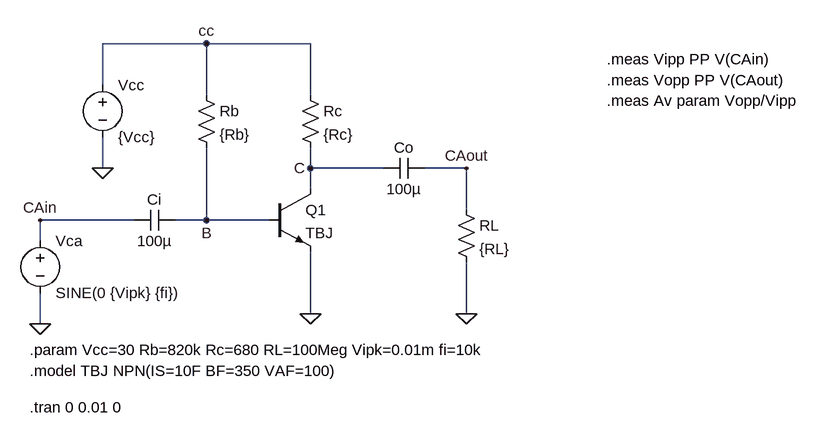
[diagram p0: schematic TBJ01CAAv.asc]
TBJ01CAAv.asc, the LTspice schematic file:
Version 4
SHEET 1 1608 928
WIRE 128 -16 -32 -16
WIRE 288 -16 128 -16
WIRE -32 48 -32 -16
WIRE 128 64 128 -16
WIRE 288 64 288 -16
WIRE -32 176 -32 128
WIRE 288 176 288 144
WIRE 400 176 288 176
WIRE 528 176 464 176
WIRE 288 208 288 176
WIRE 528 240 528 176
WIRE 16 256 -128 256
WIRE 128 256 128 144
WIRE 128 256 80 256
WIRE 224 256 128 256
WIRE -128 288 -128 256
WIRE 288 400 288 304
WIRE 528 400 528 320
WIRE -128 416 -128 368
FLAG -32 176 0
FLAG 288 400 0
FLAG -128 416 0
FLAG 128 -16 cc
FLAG -128 256 CAin
FLAG 528 400 0
FLAG 528 176 CAout
FLAG 128 256 B
FLAG 288 176 C
SYMBOL res 112 48 R0
SYMATTR InstName Rb
SYMATTR Value {Rb}
SYMBOL res 272 48 R0
SYMATTR InstName Rc
SYMATTR Value {Rc}
SYMBOL voltage -32 32 R0
WINDOW 123 0 0 Left 0
WINDOW 39 0 0 Left 0
SYMATTR InstName Vcc
SYMATTR Value {Vcc}
SYMBOL npn 224 208 R0
SYMATTR InstName Q1
SYMATTR Value TBJ
SYMBOL cap 80 240 R90
WINDOW 0 0 32 VBottom 2
WINDOW 3 32 32 VTop 2
SYMATTR InstName Ci
SYMATTR Value 100µ
SYMBOL cap 464 160 R90
WINDOW 0 0 32 VBottom 2
WINDOW 3 32 32 VTop 2
SYMATTR InstName Co
SYMATTR Value 100µ
SYMBOL voltage -128 272 R0
WINDOW 123 0 0 Left 0
WINDOW 39 0 0 Left 0
SYMATTR InstName Vca
SYMATTR Value SINE(0 {Vipk} {fi})
SYMBOL res 512 224 R0
SYMATTR InstName RL
SYMATTR Value {RL}
TEXT -144 544 Left 2 !.tran 0 0.01 0
TEXT 744 8 Left 2 !.meas Vipp PP V(CAin)
TEXT 744 40 Left 2 !.meas Vopp PP V(CAout)
TEXT 744 72 Left 2 !.meas Av param Vopp/Vipp
TEXT -144 456 Left 2 !.param Vcc=30 Rb=820k Rc=680 RL=100Meg Vipk=0.01m fi=10k
TEXT -144 488 Left 2 !.model TBJ NPN(IS=10F BF=350 VAF=100)

The netlist it stands for:
* TBJ01CAAv.asc
Rb cc B {Rb}
Rc cc C {Rc}
Vcc cc 0 {Vcc}
Q1 C B 0 0 TBJ
Ci B CAin 100µ
Co CAout C 100µ
Vca CAin 0 SINE(0 {Vipk} {fi})
RL CAout 0 {RL}
.model NPN NPN
.model PNP PNP
.lib standard.bjt
.tran 0 0.01 0
.meas Vipp PP V(CAin)
.meas Vopp PP V(CAout)
.meas Av param Vopp/Vipp
.param Vcc=30 Rb=820k Rc=680 RL=100Meg Vipk=0.01m fi=10k
.model TBJ NPN(IS=10F BF=350 VAF=100)
.backanno
.end